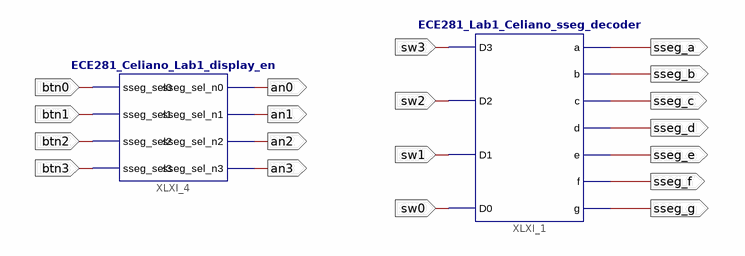
[diagram p0: schematic sheet 1]
// Xilinx ISE schematic ECE281_Celiano_Lab1_Top.sch (spartan3e) as structural Verilog: 2 symbols, 19 ports
module ECE281_Celiano_Lab1_Top (
  input  sw3,
  input  sw2,
  input  sw1,
  input  sw0,
  input  btn0,
  input  btn1,
  input  btn2,
  input  btn3,
  output sseg_a,
  output sseg_b,
  output sseg_c,
  output sseg_d,
  output sseg_e,
  output sseg_f,
  output sseg_g,
  output an0,
  output an1,
  output an2,
  output an3
);

  ECE281_Lab1_Celiano_sseg_decoder XLXI_1 (
    .D3(sw3), .D2(sw2), .D1(sw1), .D0(sw0), .a(sseg_a), .b(sseg_b), .c(sseg_c), .d(sseg_d), .e(sseg_e),
    .f(sseg_f), .g(sseg_g));
  ECE281_Celiano_Lab1_display_en XLXI_4 (
    .sseg_sel0(btn0), .sseg_sel1(btn1), .sseg_sel2(btn2), .sseg_sel3(btn3), .sseg_sel_n0(an0),
    .sseg_sel_n1(an1), .sseg_sel_n2(an2), .sseg_sel_n3(an3));
endmodule
